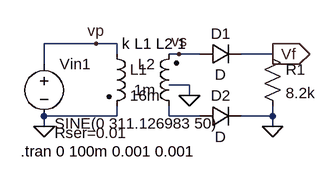
[diagram p0: schematic Draft5.asc]
Draft5.asc, the LTspice schematic file:
Version 4
SHEET 1 880 680
WIRE 128 80 48 80
WIRE 160 80 128 80
WIRE 160 96 160 80
WIRE 256 96 240 96
WIRE 288 96 256 96
WIRE 400 96 352 96
WIRE 48 112 48 80
WIRE 272 144 240 144
WIRE 272 160 272 144
WIRE 160 192 160 176
WIRE 160 192 48 192
WIRE 240 192 240 176
WIRE 288 192 240 192
WIRE 400 192 400 176
WIRE 400 192 352 192
WIRE 48 208 48 192
WIRE 400 208 400 192
FLAG 48 208 0
FLAG 400 208 0
FLAG 400 96 Vf
IOPIN 400 96 Out
FLAG 256 96 vs
FLAG 128 80 vp
FLAG 272 160 0
SYMBOL ind2 144 80 R0
SYMATTR InstName L1
SYMATTR Value 16m
SYMATTR Type ind
SYMBOL ind2 256 192 R180
WINDOW 0 36 80 Left 2
WINDOW 3 36 40 Left 2
SYMATTR InstName L2
SYMATTR Value 1m
SYMATTR Type ind
SYMBOL voltage 48 96 R0
WINDOW 3 16 107 Left 2
WINDOW 123 0 0 Left 0
WINDOW 39 16 122 Left 2
SYMATTR InstName Vin1
SYMATTR Value SINE(0 311.126983 50)
SYMATTR SpiceLine Rser=0.01
SYMBOL diode 288 112 R270
WINDOW 0 32 32 VTop 2
WINDOW 3 0 32 VBottom 2
SYMATTR InstName D1
SYMBOL res 384 80 R0
SYMATTR InstName R1
SYMATTR Value 8.2k
SYMBOL diode 288 208 R270
WINDOW 0 32 32 VTop 2
WINDOW 3 0 32 VBottom 2
SYMATTR InstName D2
TEXT 168 80 Left 2 !k L1 L2 1
TEXT 12 246 Left 2 !.tran 0 100m 0.001 0.001

The netlist it stands for:
* Draft5.asc
L1 vp 0 16m
L2 N001 vs 1m
Vin1 vp 0 SINE(0 311.126983 50) Rser=0.01
D1 vs Vf D
R1 Vf 0 8.2k
D2 N001 0 D
.model D D
.lib standard.dio
k L1 L2 1
.tran 0 100m 0.001 0.001
.backanno
.end